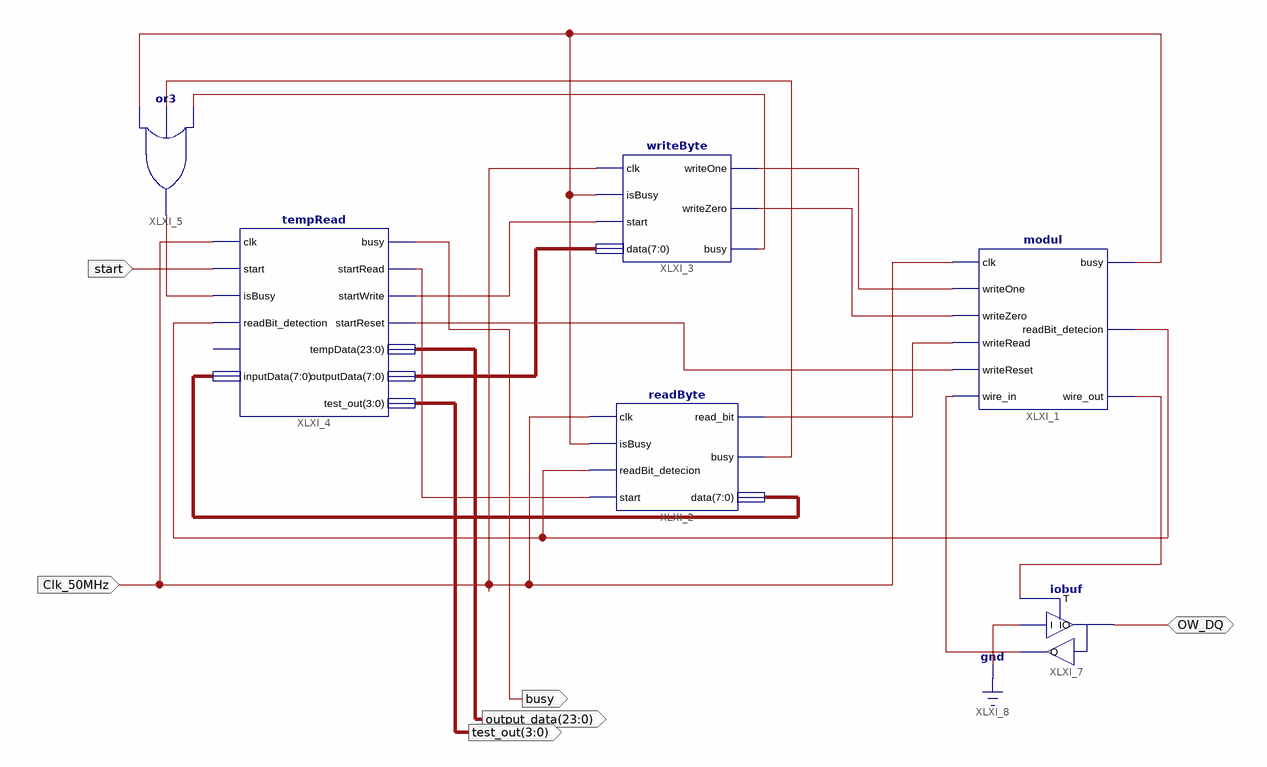
[diagram p0: schematic sheet 1]
// Xilinx ISE schematic sequenceTestSchema.sch (spartan3e) as structural Verilog: 6 symbols, 6 ports
module sequenceTestSchema (
  input  Clk_50MHz,
  input  start,
  inout  OW_DQ,
  output [3:0] test_out,
  output [23:0] output_data,
  output busy
);

  wire XLXN_1, XLXN_2, XLXN_3, XLXN_4, XLXN_5, XLXN_6, XLXN_8, XLXN_10, XLXN_14, XLXN_15, XLXN_18, XLXN_26,
       XLXN_27;
  wire [7:0] XLXN_16, XLXN_17;

  modul XLXI_1 (
    .clk(Clk_50MHz), .writeOne(XLXN_6), .writeZero(XLXN_5), .writeRead(XLXN_4), .writeReset(XLXN_3),
    .wire_in(XLXN_27), .busy(XLXN_10), .readBit_detecion(XLXN_8), .wire_out(XLXN_26));
  readByte XLXI_2 (
    .clk(Clk_50MHz), .isBusy(XLXN_10), .readBit_detecion(XLXN_8), .start(XLXN_2), .read_bit(XLXN_4),
    .busy(XLXN_15), .data(XLXN_17));
  writeByte XLXI_3 (
    .clk(Clk_50MHz), .isBusy(XLXN_10), .start(XLXN_1), .data(XLXN_16), .writeOne(XLXN_6), .writeZero(XLXN_5),
    .busy(XLXN_14));
  tempRead XLXI_4 (
    .clk(Clk_50MHz), .start(start), .isBusy(XLXN_18), .readBit_detection(XLXN_8), .inputData(XLXN_17),
    .busy(busy), .startRead(XLXN_2), .startWrite(XLXN_1), .startReset(XLXN_3), .tempData(output_data),
    .outputData(XLXN_16), .test_out(test_out));  // open: wire_in
  or XLXI_5 (XLXN_18, XLXN_10, XLXN_15, XLXN_14);
  iobuf XLXI_7 (.I(1'b0), .IO(OW_DQ), .O(XLXN_27), .T(XLXN_26));
endmodule
